# Altium schematic sheet MCX_Mezzanine.SchDoc: DIO MCX 16
size 420 x 297 mm; Author: G.Kasprowicz; CompanyName: WUT ISE; DrawnBy: G.Kasprowicz; Organization: WUT ISE; Address1: PW ISE; Address2: Nowowiejska 15/19 00-665 Warsaw; Address3: gkasprow@gmail.com; DocumentNumber: 6; Revision: 2; SheetNumber: 1; SheetTotal: 2; ModifiedBy: -; CheckedDate: -; Title2: Mezzanine; DivGrp: WUT ISE; Designer: G.Kasprowicz; ModifiedDate: -; ProjectName: Sensor Box
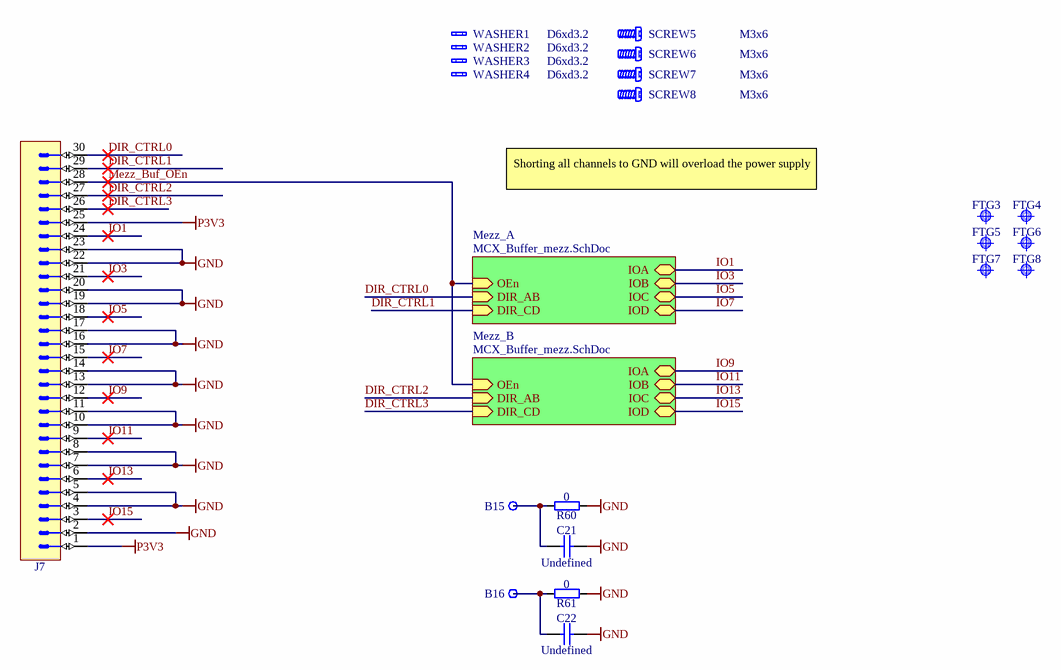
[diagram p0: MCX_Mezzanine.SchDoc]

## Parts
B15  Plated Hole  [MTG270_500]  (value not drawn)
B16  Plated Hole  [MTG270_500]  (value not drawn)
C21  Undefined  [CAPC2012X135N]
C22  Undefined  [CAPC2012X135N]
FTG3  Use only in PCB  [FIDUCIAL_TOP_S100-200]  (value not drawn)
FTG4  Use only in PCB  [FIDUCIAL_TOP_C100-200]  (value not drawn)
FTG5  Use only in PCB  [FIDUCIAL_TOP_S100-200]  (value not drawn)
FTG6  Use only in PCB  [FIDUCIAL_TOP_C100-200]  (value not drawn)
FTG7  Use only in PCB  [FIDUCIAL_TOP_C100-200]  (value not drawn)
FTG8  Use only in PCB  [FIDUCIAL_TOP_S100-200]  (value not drawn)
J7  AMPMODU  [TYCO_1-215307-5]  (value not drawn)
R60  0  [RESC1608X55N]
R61  0  [RESC1608X55N]
SCREW5  M3x6  [BOSSARD_BN5687-3061605_v]
SCREW6  M3x6  [BOSSARD_BN5687-3061605_v]
SCREW7  M3x6  [BOSSARD_BN5687-3061605_v]
SCREW8  M3x6  [BOSSARD_BN5687-3061605_v]
WASHER1  D6xd3.2  [BOSSARD_B3/6/0.3/BN1976_v]
WASHER2  D6xd3.2  [BOSSARD_B3/6/0.3/BN1976_v]
WASHER3  D6xd3.2  [BOSSARD_B3/6/0.3/BN1976_v]
WASHER4  D6xd3.2  [BOSSARD_B3/6/0.3/BN1976_v]

## Sub-sheets
Mezz_A = MCX_Buffer_mezz.SchDoc: IOA (bidir), IOB (bidir), IOC (bidir), IOD (bidir), DIR_AB (in), OEn (in), DIR_CD (in)
Mezz_B = MCX_Buffer_mezz.SchDoc: OEn (in), DIR_AB (in), DIR_CD (in), IOA (bidir), IOB (bidir), IOC (bidir), IOD (bidir)

## Nets
GND: C21.2 C22.2 J7.2 J7.4 J7.5 J7.7 J7.8 J7.10 J7.11 J7.13 J7.14 J7.16 J7.17 J7.19 J7.20 J7.22 J7.23 R60.1 R61.1
P3V3: J7.1 J7.25
DIR_CTRL0: J7.30 ; sheet Mezz_A/DIR_AB
DIR_CTRL1: J7.29 ; sheet Mezz_A/DIR_CD
DIR_CTRL2: J7.27 ; sheet Mezz_B/DIR_AB
DIR_CTRL3: J7.26 ; sheet Mezz_B/DIR_CD
IO1: J7.24 ; sheet Mezz_A/IOA
IO3: J7.21 ; sheet Mezz_A/IOB
IO5: J7.18 ; sheet Mezz_A/IOC
IO7: J7.15 ; sheet Mezz_A/IOD
IO9: J7.12 ; sheet Mezz_B/IOA
IO11: J7.9 ; sheet Mezz_B/IOB
IO13: J7.6 ; sheet Mezz_B/IOC
IO15: J7.3 ; sheet Mezz_B/IOD
Mezz_Buf_OEn: J7.28 ; sheet Mezz_A/OEn, sheet Mezz_B/OEn
NetB15_1: B15.1 C21.1 R60.2
NetB16_1: B16.1 C22.1 R61.2

## Notes on the sheet
- Shorting all channels to GND will overload the power supply
- Project/Equipment
- Document
- Designer
- Drawn by
- Check.by
- Copyright WUT ISE 2018.
  This documentation describes Open Hardware and is licensed under the CERN OHL v.1.1. You may redistribute and modify this documentation under the terms of the CERN OHL v.1.1. (http://ohwr.org/CERNOHL). This documentation is distributed WITHOUT ANY EXPRESS OR IMPLIED WARRANTY, INCLUDING OF MERCHANTABILITY, SATISFACTORY QUALITY AND FITNESS FOR A PARTICULAR PURPOSE. Please see the CERN OHL v.1.1 for applicable conditions.
- Contact
- File
- Last Mod.
- Print Date
- Sheet
- Size
- A3
- of
- Rev

## Library data of the parts
B15 B16 = PLATED_HOLE2.7_PAD5.0: Single Terminal Socket; Part Description: Plated Through Hole: Hole Dia.=2.7mm Pad Dia.=5.0mm; Mounted: No; Part Number: PLATED_HOLE2.7_PAD5.0; Component Kind: Standard (No BOM); Component Type: Standard (No BOM); Pin Count: 1; Family: Plated Hole; Socket: No; SMD: No; Sense: No; Status: None; ComponentHeight: 0mm; HelpURL: Undefined; Author: CERN DEM JMW; CreateDate: 27.09.2011; LatestRevisionDate: 27.09.2011; PackageDescription: Plated Through Hole: Hole Dia.=2.7mm Pad Dia.=5.0mm
C21 C22 = CC0805_NO-VALUE: Non-polarised capacitor; Part Description: Reserved Footprint For 0805(2012) Chip Ceramic Capacitor; Mounted: No; Part Number: CC0805_NO-VALUE; Component Kind: Standard; Component Type: Standard; Pin Count: 2; Value: Undefined; Status: None; Manufacturer: Undefined; Manufacturer Part Number: CC0805_NO-VALUE; Case: 0805; Socket: No; SMD: Yes; Sense: No; Manufacturer1 ComponentHeight: 1.35mm; HelpURL: Undefined; Author: CERN DEM JLC; CreateDate: 10.12.2008; LatestRevisionDate: 11.09.2013
FTG3 FTG5 FTG8 = FIDUCIAL_TARGET_S100-200: Fiducial Target; Part Description: Square Fiducial Target, Top Layer, 1.0mm, Top Solder 2.0mm, Keepout =2.0mm; Mounted: No; Part Number: FIDUCIAL_TARGET_S100-200; Component Kind: Standard (No BOM); Component Type: Standard (No BOM); Pin Count: 1; Family: Fiducial; Socket: No; SMD: Yes; Sense: No; Status: None; ComponentHeight: 0mm; HelpURL: Undefined; Author: CERN DEM JLC; CreateDate: 09.02.2010; LatestRevisionDate: 04.04.2012; PackageDescription: Square Fiducial Target, Top Layer, 1.0mm, Top Solder 2.0mm, Keepout =2.0mm
FTG4 FTG6 FTG7 = FIDUCIAL_TARGET_C100-200: Fiducial Target; Part Description: Round Fiducial Target, Top Layer, 1.0mm, Top Solder 2.0mm, Keepout =2.0mm; Mounted: No; Part Number: FIDUCIAL_TARGET_C100-200; Component Kind: Standard (No BOM); Component Type: Standard (No BOM); Pin Count: 1; Family: Fiducial; Socket: No; SMD: Yes; Sense: No; Status: None; ComponentHeight: 0mm; HelpURL: Undefined; Author: CERN DEM JLC; CreateDate: 09.02.2010; LatestRevisionDate: 04.04.2012; PackageDescription: Round Fiducial Target, Top Layer, 1.0mm, Top Solder 2.0mm, Keepout =2.0mm
J7 = CON_2x15_2.54_female_V_mirror: Connector 2.54mm, 30 pin female, vertical, 7mm, AMPMODU HV-100/HV-190; Part Description: 34 Contacts, Dual Row Vertical Low Profile IDC Shrouded Header, with Long Eject Latch; Manufacturer: TYCO ELECTRONICS; Manufacturer Part Number: 1-215307-5; PressFit: No; Part Number: TYCO_1-215307-5; Component Kind: Standard; Component Type: Standard; Pin Count: 30; Family: AMPMODU; Mounted: Yes; Socket: No; SMD: No; Sense: No; Status: None; ComponentHeight: 22.86mm; HelpURL: \\cern.ch\dfs\Applications\Altium\Datasheets\TYCO_3-1761606-1.pdf; Author: GK; CreateDate: 05.10.2015; LatestRevisionDate: 05.10.2015
R60 R61 = R0603_0R_JUMPER: Resistor; Part Description: 1A (0.05R Max DC Resistance) Zero Ohm Jumper; Manufacturer: GENERIC; Manufacturer1 Part Number: NRC06Z0; PressFit: No; Part Number: R0603_0R_JUMPER; Component Kind: Standard; Component Type: Standard; Pin Count: 2; Value: 0; Status: Preferred; Manufacturer Part Number: R0603_0R_JUMPER; Case: 0603; Mounted: Yes; Sense: No; Socket: No; SMD: Yes; Manufacturer1 Example: NIC COMPONENT; Manufacturer1 ComponentHeight: 0.55mm; HelpURL: \\cern.ch\dfs\Applications\Altium\Datasheets\R0603_NIC_NRC.pdf; Author: CERN DEM JLC; CreateDate: 03.12.2007; LatestRevisionDate: 13.03.2008
SCREW5-SCREW8 = BOSSARD_BN5687-3061605_v: Screw; Part Description: M3 L=6mm Hexalobular Socket Pan Head Screw, Fully Threaded, Stainless Steel A2; Manufacturer Part Number: BN5687 Art.3061605; PressFit: No; Part Number: BOSSARD_BN5687-3061605_v; Component Kind: Standard; Component Type: Mechanical; Pin Count: 0; PackageDescription: M3 L=6mm Hexalobular Socket Pan Head Screw, Fully Threaded - Stainless Steel A2; Mounted: Yes; Socket: No; SMD: No; Sense: No; Status: None; Value: M3x6; Manufacturer: BOSSARD; ComponentHeight: 2.4mm; HelpURL: \\cern.ch\dfs\Applications\Altium\Datasheets\BOSSARD_BN5687-3061605.pdf; Author: CERN DEM JLC; CreateDate: 15.01.2013; LatestRevisionDate: 15.01.2013
WASHER1-WASHER4 = MECH_Washer_M3x0.3x6: Washer, M3x0.3x6; Part Number: BOSSARD_B3/6/0.3/BN1976; Part Description: Flat Washer without Chamfer for M3 Screw, Steel; Manufacturer: BOSSARD; Manufacturer Part Number: B3/6/0.3/BN1976; PressFit: No; Component Kind: Standard; Component Type: Mechanical; Pin Count: 0; PackageDescription: Flat Washer without Chamfer for M3 Screw, steel; Mounted: Yes; Socket: No; SMD: No; Sense: No; Status: None; Value: D6xd3.2; ComponentHeight: 0.5mm; HelpURL: \\cern.ch\dfs\Applications\Altium\Datasheets\BOSSARD_BN1074-1404830.pdf; Author: GK; CreateDate: 08.03.2018; LatestRevisionDate: 08.03.2018